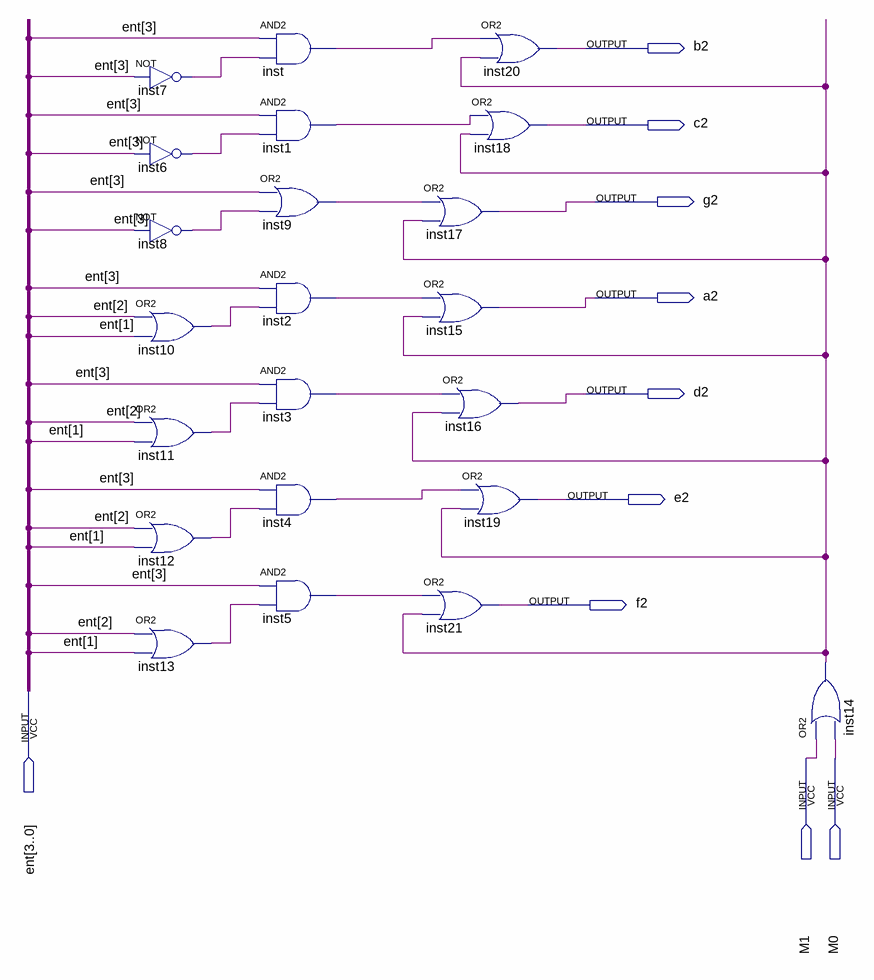
[diagram p0: schematic sheet]
// Quartus schematic DecodificadorEntarada-DisplayEsquerda.bdf as structural Verilog: 22 symbols, 10 pins
module \DecodificadorEntarada-DisplayEsquerda  (
  input  [3:0] ent,
  input  M1,
  input  M0,
  output b2,
  output c2,
  output g2,
  output a2,
  output d2,
  output e2,
  output f2
);

  wire inst1_out, inst2_out, inst3_out, inst4_out, inst5_out, inst6_out, inst7_out, inst8_out, inst9_out,
       inst10_out, inst11_out, inst12_out, inst13_out, inst14_out, inst_out;

  not inst7 (inst7_out, ent[3]);
  not inst6 (inst6_out, ent[3]);
  not inst8 (inst8_out, ent[3]);
  or inst10 (inst10_out, ent[2], ent[1]);
  or inst11 (inst11_out, ent[2], ent[1]);
  or inst12 (inst12_out, ent[2], ent[1]);
  or inst13 (inst13_out, ent[2], ent[1]);
  and inst (inst_out, ent[3], inst7_out);
  and inst1 (inst1_out, ent[3], inst6_out);
  or inst9 (inst9_out, ent[3], inst8_out);
  and inst2 (inst2_out, ent[3], inst10_out);
  and inst3 (inst3_out, ent[3], inst11_out);
  and inst4 (inst4_out, ent[3], inst12_out);
  and inst5 (inst5_out, ent[3], inst13_out);
  or inst17 (g2, inst9_out, inst14_out);
  or inst15 (a2, inst2_out, inst14_out);
  or inst16 (d2, inst3_out, inst14_out);
  or inst19 (e2, inst4_out, inst14_out);
  or inst21 (f2, inst5_out, inst14_out);
  or inst20 (b2, inst_out, inst14_out);
  or inst18 (c2, inst1_out, inst14_out);
  or inst14 (inst14_out, M1, M0);
endmodule
